# EAGLE design SparkFun_Pressure_Sensor_BMP581_Qwiic_Micro (EAGLE 9.6.2)
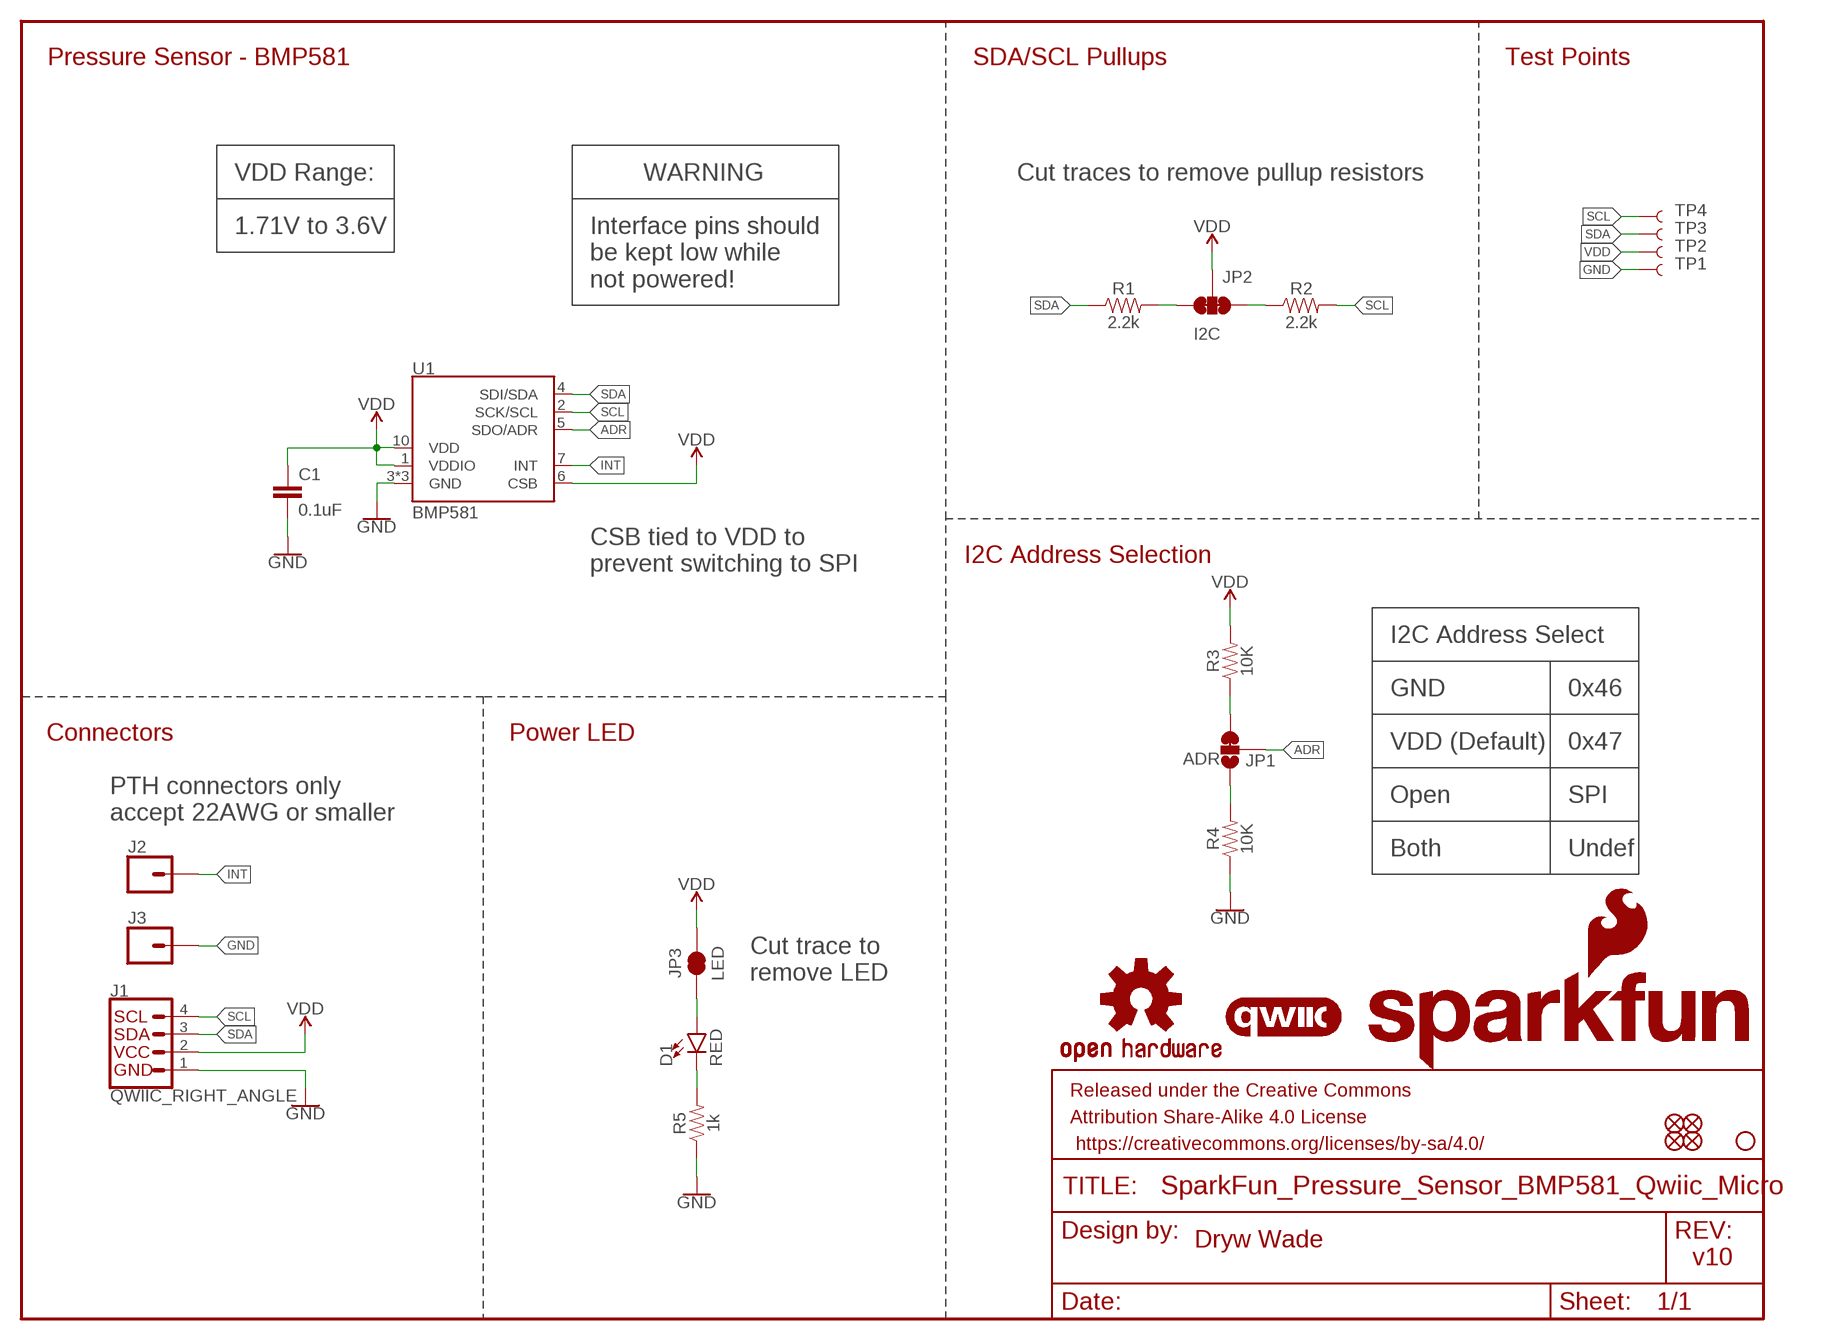
[diagram p0: schematic, sheet 1]

## Parts
C1  0.1uF  0.1UF-0402T-6.3V-10%-X7R  [0402-TIGHT]
D1  RED  LED-RED_0402  [LED-0402]
FD1  FIDUCIALUFIDUCIAL  [FIDUCIAL-MICRO]
FD2  FIDUCIALUFIDUCIAL  [FIDUCIAL-MICRO]
FD3  FIDUCIALUFIDUCIAL  [FIDUCIAL-MICRO]
FD4  FIDUCIALUFIDUCIAL  [FIDUCIAL-MICRO]
FRAME1  FRAME-LETTER  [CREATIVE_COMMONS]
H1  STAND-OFF  [STAND-OFF]
J1  QWIIC_RIGHT_ANGLE  QWIIC_CONNECTORJS-1MM  [JST04_1MM_RA]
J2  CONN_01_1MM  [1X01_1MM_NO_SILK]
J3  CONN_01_1MM  [1X01_1MM_NO_SILK]
JP1  ADR  JUMPER-SMT_3_1-NC_TRACE_SILK  [SMT-JUMPER_3_1-NC_TRACE_SILK]
JP2  I2C  JUMPER-SMT_3_2-NC_TRACE_SILK  [SMT-JUMPER_3_2-NC_TRACE_SILK]
JP3  LED  JUMPER-SMT_2_NC_TRACE_SILK  [SMT-JUMPER_2_NC_TRACE_SILK]
LOGO1  OSHW-LOGOMINI  [OSHW-LOGO-MINI]
LOGO2  SFE_LOGO_FLAME.1_INCH  [SFE_LOGO_FLAME_.1]
LOGO3  QWIIC_LOGO_3MM  [QWIIC_3MM]
LOGO4  SFE_LOGO_NAMEBLANK  [BLANK]
R1  2.2k  2.2KOHM-0402T-1/16W-1%  [0402-TIGHT]
R2  2.2k  2.2KOHM-0402T-1/16W-1%  [0402-TIGHT]
R3  10K  10KOHM-0402-1/10W-0.1%  [0402-TIGHT]
R4  10K  10KOHM-0402-1/10W-0.1%  [0402-TIGHT]
R5  1k  1KOHM-0402T-1/16W-1%  [0402-TIGHT]
TP1  TEST-POINT3  [PAD.03X.03]
TP2  TEST-POINT3  [PAD.03X.03]
TP3  TEST-POINT3  [PAD.03X.03]
TP4  TEST-POINT3  [PAD.03X.03]
U1  BMP581  [BMP581]

## Nets
ADR: JP1.2 U1.5(SDO/ADR)
GND: C1.2 J1.1 J3.1 R4.1 R5.1 TP1.1 U1.3(GND) U1.8(GND) U1.9(GND)
INT: J2.1 U1.7(INT)
N$1: JP1.3 R3.1
N$2: JP1.1 R4.2
N$3: JP2.1 R2.1
N$4: JP2.3 R1.2
N$5: D1.A JP3.1
N$6: D1.C R5.2
SCL: J1.4 R2.2 TP4.1 U1.2(SCK/SCL)
SDA: J1.3 R1.1 TP3.1 U1.4(SDI/SDA)
VDD: C1.1 J1.2 JP2.2 JP3.2 R3.2 TP2.1 U1.1(VDDIO) U1.6(CSB) U1.10(VDD)

## Notes on the sheet
- Pressure Sensor - BMP581 | SDA/SCL Pullups | Test Points
- VDD Range: | WARNING | Cut traces to remove pullup resistors
- 1.71V to 3.6V
- Interface pins should
  be kept low while
  not powered!
- I2C Address Selection
- CSB tied to VDD to
  prevent switching to SPI
- I2C Address Select
- GND | 0x46
- Connectors | Power LED
- VDD (Default) | 0x47
- Open | SPI
- PTH connectors only
  accept 22AWG or smaller
- Both | Undef
- Cut trace to
  remove LED
- Dryw Wade
- v10

## Library data of the parts
C1 = SparkFun-Capacitors:0.1UF: 0.1µF ceramic capacitors A capacitor is a passive two-terminal electrical component used to store electrical energy temporarily in an electric field.; PROD_ID: CAP-14993
D1 = SparkFun-LED:LED-RED: Red SMD LED Used in manufacturing of most products at SparkFun Packages: 0603 - SMD 0603 package [Product Link] <http://docs.avagotech.com/docs/AV02-0551EN> 0603 SMART - SMD 0603 SMART package ( more efficient and expensive)[Product Link] <http://www.osram-os.com/Graphics/XPic2/00077099_0.pdf> 1206 - SMD1206 package [Product Link] <https://www.sparkfun.com/datasheets/DevTools/LilyPad/Q150OVS4.pdff> SparkFun Products: Pro Mini 328 -5V <https://www.sparkfun.com/products/821> RedBoard <https://www.sparkfun.com/products/12757> IOIO-OTG <https://www.sparkfun.com/products/13613>; PROD_ID: DIO-16757
FD1-FD4 = SparkFun-Aesthetics:FIDUCIAL: Fiducial Alignment Points Point-of-reference for pick-and-place machines and other optical instruments.
FRAME1 = SparkFun-Aesthetics:FRAME-LETTER: Schematic Frame - Letter Standard 8.5x11 US Letter frame
H1 = SparkFun-Hardware:STAND-OFF: Stand Off Drill holes for mechanically mounting via screws, standoffs, etc. Note: Use the keepout ring to avoid running the screw head into surrounding components. Variant Overviews STAND-OFF - Mechanical footprint for a #4 phillips button head screw. STAND-OFF-TIGHT - Mechanical footprint for a #4 phillips button head screw, Example SparkFun Products Screw - Phillips Head (1/4", 4-40, 10 pack) <https://www.sparkfun.com/products/10453> (PRT-10453) Screw - Phillips Head (1/2", 4-40, 10 pack) <https://www.sparkfun.com/products/10452> (PRT-10452) Screw - Phillips Head (3/4", 4-40, 10 pack) <https://www.sparkfun.com/products/10451> (PRT-10451) Screw - Phillips Head (1", 4-40, 10 pack) <https://www.sparkfun.com/products/10450> (PRT-10450)
J1 = SparkFun-Connectors:QWIIC_CONNECTOR: SparkFun I2C Standard Qwiic Connector An SMD 1mm pitch JST connector makes it easy and quick (get it? Qwiic?) to connect I2C devices to each other. The Qwiic system <http://www.sparkfun.com/qwiic> enables fast and solderless connection between popular platforms and various sensors and actuators. We carry 200mm <https://www.sparkfun.com/products/14204>, 100mm <https://www.sparkfun.com/products/14205>, 50mm <https://www.sparkfun.com/products/14206>, and breadboard friendly <https://www.sparkfun.com/products/14207> Qwiic cables. We also offer 10 pcs strips <https://www.sparkfun.com/products/14323> the SMD connectors.; PROD_ID: CONN-13694
J2 J3 = SparkFun-Connectors:CONN_01: Single connection point. Often used as Generic Header-pin footprint for 0.1 inch spaced/style header connections On any of the 0.1 inch spaced packages, you can populate with these: Break Away Headers - Straight <https://www.sparkfun.com/products/116> (PRT-00116) Break Away Male Headers - Right Angle <https://www.sparkfun.com/products/553> (PRT-00553) Female Headers <https://www.sparkfun.com/products/115> (PRT-00115) Break Away Headers - Machine Pin <https://www.sparkfun.com/products/117> (PRT-00117) Break Away Female Headers - Swiss Machine Pin <https://www.sparkfun.com/products/743> (PRT-00743) This device is also useful as a general connection point to wire up your design to another part of your project. Our various solder wires solder well into these plated through hole pads. Hook-Up Wire - Assortment (Stranded, 22 AWG) <https://www.sparkfun.com/products/11375> (PRT-11375) Hook-Up Wire - Assortment (Solid Core, 22 AWG) <https://www.sparkfun.com/products/11367> (PRT-11367) View the entire wire category on our website here <https://www.sparkfun.com/categories/141> Special notes: SMTSO-256-ET is a "flush mount" nut for a 4-40 screw. We mostly use this on specialty testbeds; it is a nice way to connect hardware to your PCB at an adjustable hieght. Also note, the SNAP packages are for using a snappable style connector. We sell a baggie of snaps and they are also used on two LilyPad designs: Snap Assortment - 30 pack (male and female) <https://www.sparkfun.com/products/11347> (DEV-11347) LilyPad Arduino SimpleSnap <https://www.sparkfun.com/products/10941> (DEV-10941) LilyPad SimpleSnap Protoboard <https://www.sparkfun.com/products/10940> (DEV-10940)
JP1 = SparkFun-Jumpers:JUMPER-SMT_3_1-NC_TRACE: Normally closed trace jumper (1 of 2 connections) This jumper has a trace between two pads so it's normally closed (NC). The other connection is normally open (NO). Use a razor knife to open the connection. For best results follow the IPC guidelines for cutting traces: Cutout at least 0.063 mm (0.005 in). Remove all loose material to clean up the cut area. Seal the cut with an approved epoxy. Reapply solder to reclose the connection, or to close the NO connection.
JP2 = SparkFun-Jumpers:JUMPER-SMT_3_2-NC_TRACE: Normally closed trace jumper (2 of 2 connections) This jumper has a trace between all three pads so they are normally closed (NC). Use a razor knife to open the connection(s). For best results follow the IPC guidelines for cutting traces: Cutout at least 0.063 mm (0.005 in). Remove all loose material to clean up the cut area. Seal the cut with an approved epoxy. Reapply solder to reclose the connection(s).
JP3 = SparkFun-Jumpers:JUMPER-SMT_2_NC_TRACE: Normally closed trace jumper This jumper has a trace between two pads so it's normally closed (NC). Use a razor knife to open the connection. For best results follow the IPC guidelines for cutting traces: Cutout at least 0.063 mm (0.005 in). Remove all loose material to clean up the cut area. Seal the cut with an approved epoxy. Reapply solder to reclose the connection.
LOGO1 = SparkFun-Aesthetics:OSHW-LOGO: Open-Source Hardware (OSHW) Logo This logo indicates the piece of hardware it is found on incorporates a OSHW license and/or adheres to the definition of open source hardware found here: http://freedomdefined.org/OSHW
LOGO2 = SparkFun-Aesthetics:SFE_LOGO_FLAME: SparkFun Flame Logo This is the SparkFun flame logo. The logo on the schematic will always be the same size; the package variant is the height of the flame. Default layer for the logo on the board is tSilk.
LOGO3 = SparkFun-Aesthetics:QWIIC_LOGO: Qwiic Logos for placement on schematic and PCB. The 5.5mm silk logo is best for placing next to Qwiic connector.
LOGO4 = SparkFun-Aesthetics:SFE_LOGO_NAME: SparkFun Font Logo This is the SparkFun name logo. The logo on the schematic will always be the same size; the package variant is the height of the flame part of the logo (or the height the flame would be, if it were drawn). Default layer for the logo on the board is tSilk.
R1 R2 = SparkFun-Resistors:2.2KOHM: 2.2kΩ resistor A resistor is a passive two-terminal electrical component that implements electrical resistance as a circuit element. Resistors act to reduce current flow, and, at the same time, act to lower voltage levels within circuits. - Wikipedia; PROD_ID: RES-14341
R3 R4 = SparkFun-Resistors:10KOHM: 10kΩ resistor A resistor is a passive two-terminal electrical component that implements electrical resistance as a circuit element. Resistors act to reduce current flow, and, at the same time, act to lower voltage levels within circuits. - Wikipedia; PROD_ID: RES-16147
R5 = SparkFun-Resistors:1KOHM: 1kΩ resistor A resistor is a passive two-terminal electrical component that implements electrical resistance as a circuit element. Resistors act to reduce current flow, and, at the same time, act to lower voltage levels within circuits. - Wikipedia; PROD_ID: RES-14342
TP1-TP4 = SparkFun-Connectors:TEST-POINT: SparkFun Test Points Bare copper test points for troubleshooting or In-Circuit-Testing. These are used by our Production team for verifying production board runs using pogo-pins on test beds. SparkFun Products: SparkFun LSM9DS1 Breakout <https://www.sparkfun.com/products/13284> SparkFun PSOC <https://www.sparkfun.com/products/13714> SparkFun Load Cell Amplifier <https://www.sparkfun.com/products/13879>
U1 = SparkFun-Sensors:BMP581: Bosch BMP581 Pressure Sensor Senses pressure from 300 hPa to 1250 hPa, sends data out over I2C or SPI; PROD_ID: IC-16798

## Board
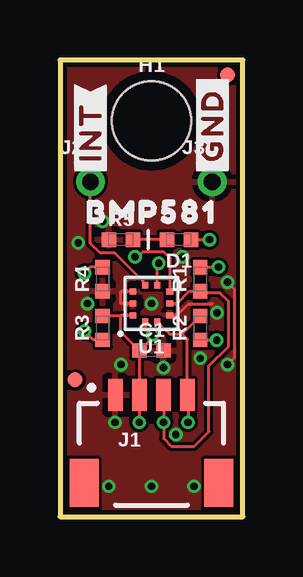
[diagram p1: board, top side]
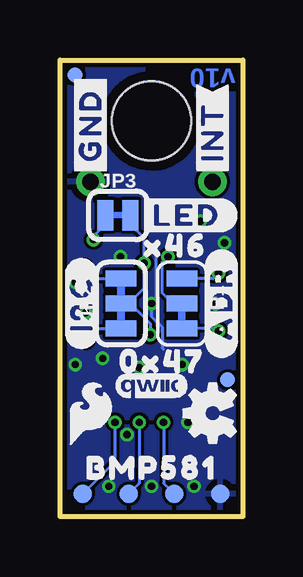
[diagram p2: board, bottom side, seen from below]

Size 7.62 x 19.05 mm. Coordinates in mm from the lower left corner, seen from the top.
Outline: 0,0 7.62,0 7.62,19.05 0,19.05 0,0
Copper layers (1*16): Top 0.035mm / dielectric 1.5mm / Bottom 0.035mm
Design rules "SparkFun-2-Layer-Minimum-JLCPCB": minimum track width 5mil, minimum drill 0.3mm, track to track 5mil, track to pad 5mil, pad to pad 5mil, via to via 5mil, smd to smd 5mil, copper to edge 7mil, drill to drill 7mil, minimum pad ring 5mil, minimum via ring 5mil, stop-mask expansion 2.5mil, vias tented up to drill 25mil, thermal gap 10mil
tRestrict: area 2.9,9.1 to 3.2,9.2; area 2.9,9.6 to 3.2,9.7; area 4.4,8.1 to 4.7,8.2; area 3.2,8.8 to 3.4,9

### Footprints (pad centres in the part's own frame; a part is rotated, then mirrored left to right if it is on the bottom)
0402-TIGHT = smd 0.6 x 0.6: 1 -0.5,0; 2 0.5,0
LED-0402 = smd 0.6 x 0.6: A -0.5,0; C 0.5,0
FIDUCIAL-MICRO = smd 0.635 x 0.635: 1 0,0
STAND-OFF = hole 3.302: 0,0
JST04_1MM_RA = smd 0.6 x 1.35: 1 -1.5,0; 2 -0.5,0; 3 0.5,0; 4 1.5,0 | smd 1.2 x 2: NC1 2.8,-3.675; NC2 -2.8,-3.675
1X01_1MM_NO_SILK = drill 0.7 pad 1.2: 1 0,0
SMT-JUMPER_3_1-NC_TRACE_SILK = smd 0.66 x 1.27: 1 -1.041,0; 2 0,0; 3 1.041,0
SMT-JUMPER_3_2-NC_TRACE_SILK = smd 0.66 x 1.27: 1 -1.041,0; 2 0,0; 3 1.041,0
SMT-JUMPER_2_NC_TRACE_SILK = smd 0.66 x 1.27: 1 -0.521,0; 2 0.521,0
PAD.03X.03 = smd 0.762 x 0.762: 1 0,0
BMP581 = smd 0.25 x 0.275: 1 0.25,0.762; 2 -0.25,0.762; 6 -0.25,-0.762; 7 0.25,-0.762 | smd 0.275 x 0.25: 3 -0.762,0.5; 4 -0.762,0; 5 -0.762,-0.5; 8 0.762,-0.5; 9 0.762,0; 10 0.762,0.5

### Placement (x,y rotation side)
C1  3.81,6.93 0 top
D1  4.95,11.56 180 top
FD1  6.99,18.41 0 top
FD2  6.99,18.41 0 bottom
FD3  0.64,5.71 0 bottom
FD4  0.64,5.71 0 top
FRAME1  -19.05,-13.97 0 top  (outside the outline)
H1  3.81,16.51 0 top
J1  3.81,5.08 0 top
J2  1.27,13.97 0 top
J3  6.35,13.97 0 top
JP1  2.54,8.89 270 bottom
JP2  5.08,8.89 90 bottom
JP3  5.21,12.57 0 bottom
LOGO1  1.27,4.32 90 bottom
LOGO2  6.35,4.32 0 bottom
LOGO3  3.81,5.46 0 bottom
LOGO4  -19.05,-13.97 0 top  (outside the outline)
R1  5.84,9.91 90 top
R2  5.84,7.87 90 top
R3  1.78,7.87 90 top
R4  1.78,9.91 90 top
R5  2.54,11.56 0 top
TP1  0.95,0.95 0 bottom
TP2  2.86,0.95 0 bottom
TP3  4.76,0.95 0 bottom
TP4  6.67,0.95 0 bottom
U1  3.81,8.89 180 top
U$1  [BMP5810]  3.81,12.7 0 top
U$2  [BMP5810]  3.81,2.03 0 bottom
U$3  [#I2C#0]  6.73,8.89 90 bottom
U$4  [#ADR#0]  0.89,8.89 90 bottom
U$5  [#GND#0]  6.35,14.1 90 top
U$6  [#GND#0]  6.35,14.1 90 bottom
U$7  [#INT#0]  1.27,14.1 90 top
U$8  [#INT#0]  1.27,14.1 90 bottom
U$9  [#LED#0]  4.45,12.57 0 bottom
U$10  [X460]  4.83,11.3 0 bottom
U$11  [0X470]  5.84,6.48 0 bottom

### Tracks (layer width: path | path; a pad name or v marks a point on that pad's centre or on a via)
ADR  (via drill 0.3)
  Top 0.127: v3.12,10.85 3.25,10.85 3.45,11.05 4.32,11.05 4.6,10.77 4.6,9.41 U1.5
  Bottom 0.127: JP1.2 2.92,8.89 3.38,9.35 3.38,10.59 v3.12,10.85
GND  (via drill 0.3)
  Top 0.127: 6.35,8.89 6.32,8.86 5.34,8.86 4.86,8.39 U1.3 | v6.99,6.35 7.28,6.64 7.28,9.49 v6.99,9.78 | U1.8 2.54,9.39 2.54,8.89 U1.9
  Bottom 0.127: 1.04,0.95 TP1.1 | 3.63,11.46 3.63,9.07 v3.81,8.89 3.81,8.36 3.37,7.92 3.37,7.05 3.3,6.99
  other vias: 2.29,3.94 3.81,1.27 2.03,1.27 5.59,1.27 4.32,6.22 6.55,8.51 1.78,12.32 4.83,3.43 0.76,11.43 5.84,6.6 2.54,6.35 1.14,8.89 5.11,10.85
  pour Top (isolate 0.127): 0,0 7.62,0 7.62,19.05 0,19.05
  pour Bottom (isolate 0.127): 0,0 7.62,0 7.62,19.05 0,19.05
INT
  Top 0.127: J2.1 1.27,11.4 1.68,10.99 2.29,10.99 3.56,9.72 U1.7
N$1  (via drill 0.3)
  Top 0.127: R3.1 1.39,7.37 v1.02,7.75
  Bottom 0.127: v1.02,7.75 1.12,7.85 JP1.3
N$2  (via drill 0.3)
  Top 0.127: R4.2 1.26,10.41 v1.02,10.16
  Bottom 0.127: v1.02,10.16 1.25,9.93 JP1.1
N$3  (via drill 0.3)
  Top 0.127: R2.1 v6.52,7.37 v6.53,7.37
  Bottom 0.127: v6.53,7.37 6.04,7.85 JP2.1
N$4  (via drill 0.3)
  Top 0.127: R1.2 v6.6,10.41
  Bottom 0.127: v6.6,10.41 6.12,9.93 JP2.3
N$5  (via drill 0.3)
  Top 0.127: D1.A v6.22,11.56
  Bottom 0.127: v6.22,11.56 6.22,11.7 5.73,12.19 JP3.1
N$6
  Top 0.127: D1.C R5.2
SCL  (via drill 0.3)
  Top 0.127: 5.09,7.62 R2.2 | 5.09,7.62 5.31,7.4 J1.4 5.33,5.06 v5.33,3.94 | 5.09,7.62 4.57,7.62 4.56,7.62 U1.2
  Bottom 0.127: v5.33,3.94 5.33,2.29 TP4.1
SDA  (via drill 0.3)
  Top 0.127: J1.3 v4.32,3.94 4.32,3.26 4.64,2.94 5.59,2.94 6.21,3.55 6.21,6.29 7.02,7.11 7.02,8.97 6.66,9.33 5.92,9.33 R1.1 5.39,9.41 4.88,8.89 U1.4
  Bottom 0.127: v4.32,3.94 4.32,1.4 TP3.1
VDD  (via drill 0.3)
  Top 0.127: C1.1 J1.2 v3.3,3.94 | C1.1 3.86,7.49 v3.86,7.59 3.56,7.89 U1.1 | C1.1 2.54,7.7 2.54,8.39 | R3.2 1.79,8.39 2.54,8.39 | v4.12,10.57 4.06,10.51 U1.6 | U1.10 2.54,8.39
  Bottom 0.127: v3.86,7.59 3.86,8.05 4.7,8.89 JP2.2 4.76,8.89 4.29,9.37 4.12,9.54 v4.12,10.57 4.12,11.62 4.69,12.19 JP3.2 | v3.3,3.94 3.3,1.4 TP2.1

### Text on the board
Bottom: v10
Measures: Units: inches
tDocu: Dryw Wade